# Altium project 九键触摸面板-控制板-V2.PrjPCB
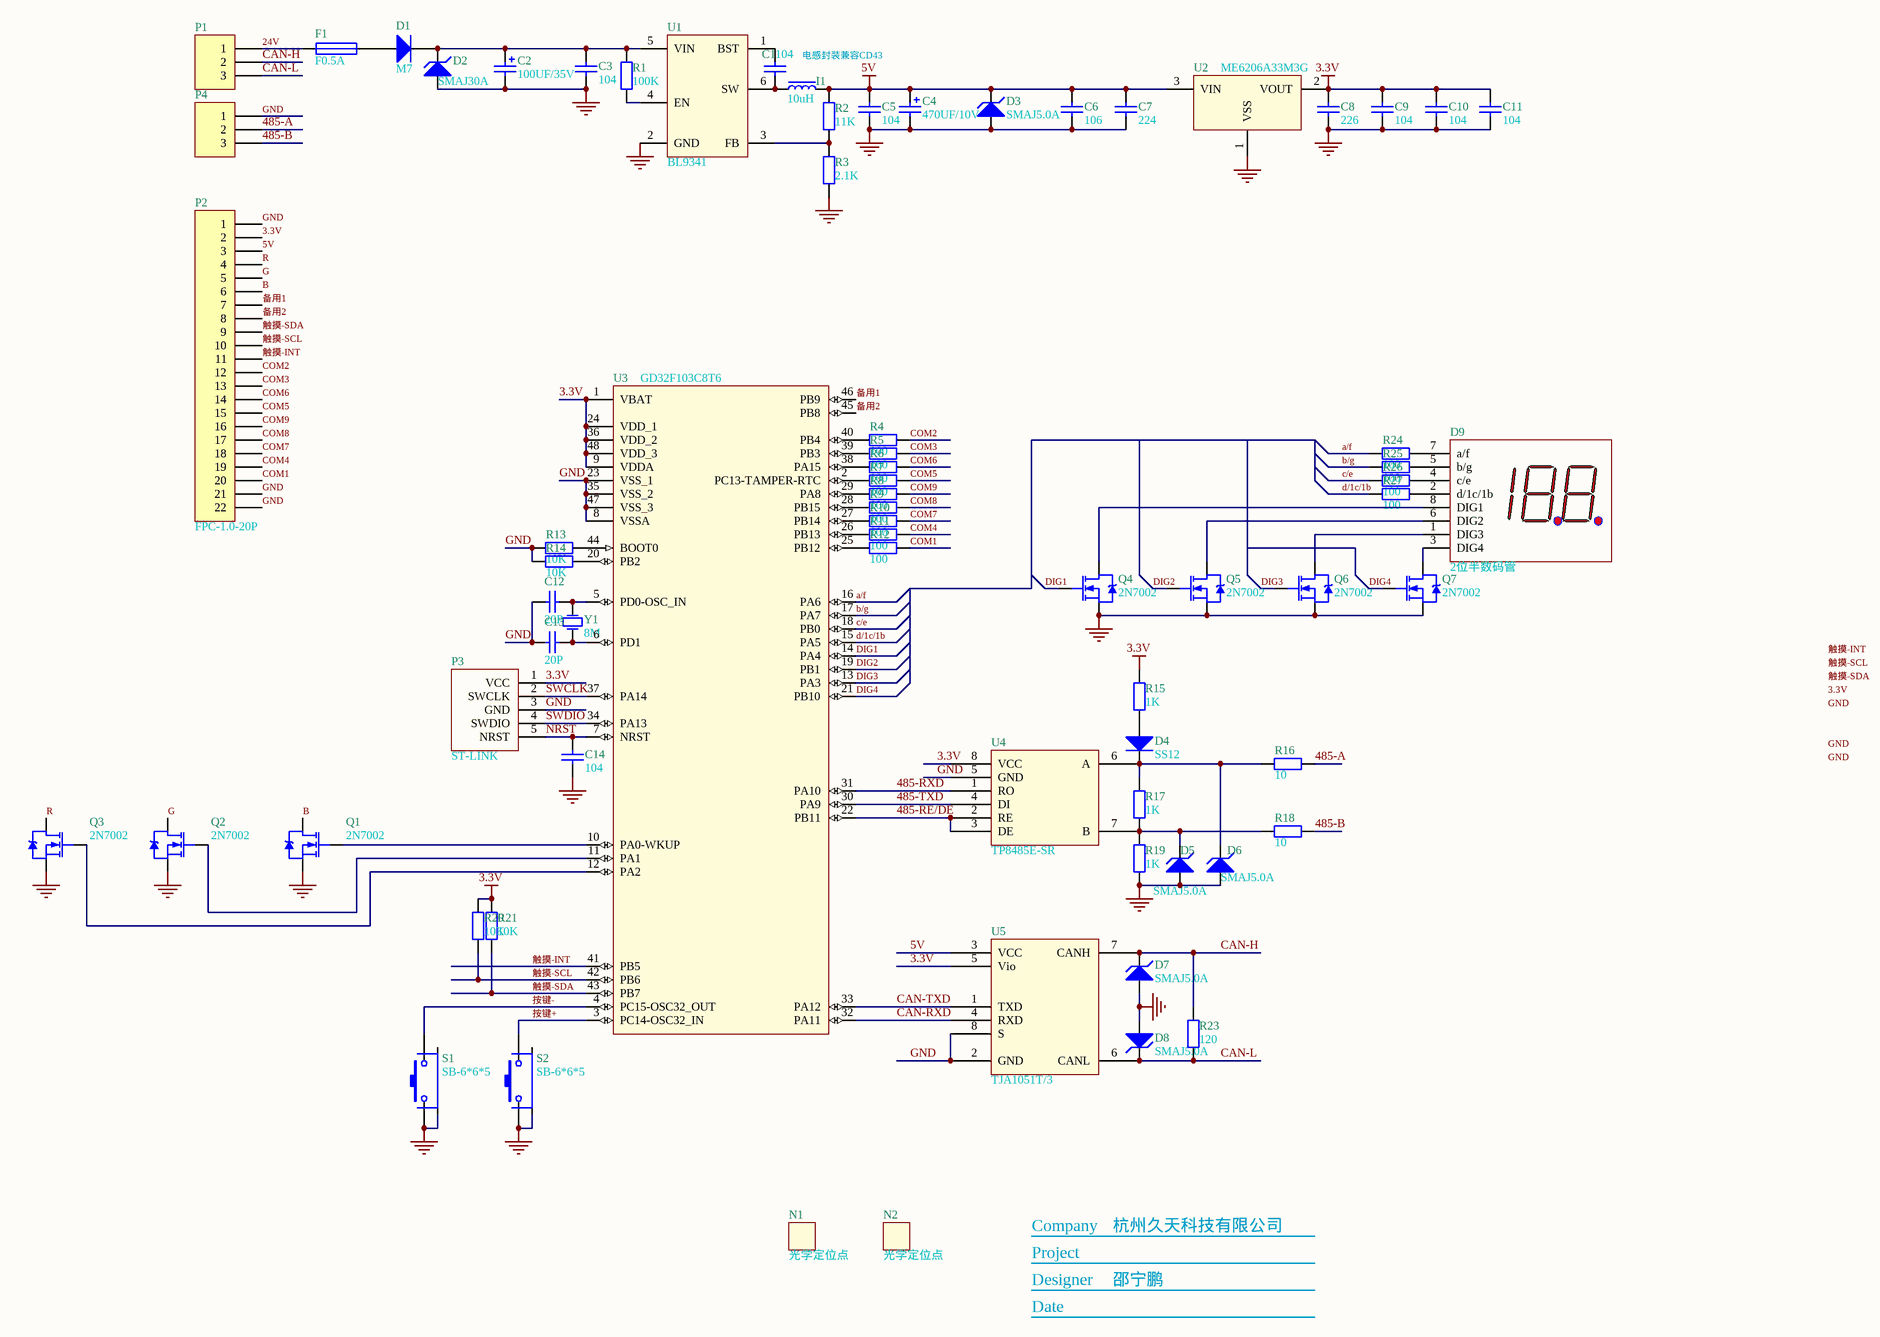
[diagram p0: 九键触摸面板-控制板-V2.SchDoc]
1 sheet, 72 parts. Net scope: global (net labels, ports and power ports of the same name join across sheets).
Board file: 九键触摸面板-控制板-V2.PcbDoc

## Sheet 九键触摸面板-控制板-V2.SchDoc
size A1

### Parts
C1  104  [C-0603]
C2  100UF/35V  [贴片固态电容6.3*7.7]
C3  104  [C-0603]
C4  470UF/10V  [贴片固态电容6.3*7.7]
C5  104  [C-0603]
C6  106  [C-0603]
C7  224  [C-0603]
C8  226  [C-0603]
C9  104  [C-0603]
C10  104  [C-0603]
C11  104  [C-0603]
C12  20P  [C-0603]
C13  20P  [C-0603]
C14  104  [C-0603]
D1  M7  [SMA]
D2  SMAJ30A  [SMA]
D3  SMAJ5.0A  [SMA]
D4  SS12  [SOD-323/0805]
D5  SMAJ5.0A  [SMA]
D6  SMAJ5.0A  [SMA]
D7  SMAJ5.0A  [SMA]
D8  SMAJ5.0A  [SMA]
D9  2位半数码管  [2位半0.25英寸]
F1  F0.5A  [FUSE-3*10带引线]
I1  10uH  [4030]
N1  光学定位点  [MARK-1mm-3mm]
N2  光学定位点  [MARK-1mm-3mm]
P1  (no value)  [KF128-3P]
P2  FPC-1.0-20P  [FPC-1.0mm_20P下接翻盖]
P3  ST-LINK  [5P下载口]
P4  (no value)  [KF128-3P]
Q1  2N7002  [SOT-23]
Q2  2N7002  [SOT-23]
Q3  2N7002  [SOT-23]
Q4  2N7002  [SOT-23]
Q5  2N7002  [SOT-23]
Q6  2N7002  [SOT-23]
Q7  2N7002  [SOT-23]
R1  100K  [R-0603]
R2  11K  [R-0603]
R3  2.1K  [R-0603]
R4  100  [R-0603]
R5  100  [R-0603]
R6  100  [R-0603]
R7  100  [R-0603]
R8  100  [R-0603]
R9  100  [R-0603]
R10  100  [R-0603]
R11  100  [R-0603]
R12  100  [R-0603]
R13  10K  [R-0603]
R14  10K  [R-0603]
R15  1K  [R-0603]
R16  10  [R-0603]
R17  1K  [R-1206]
R18  10  [R-0603]
R19  1K  [R-0603]
R20  10K  [R-0603]
R21  10K  [R-0603]
R23  120  [R-1206]
R24  100  [R-0603]
R25  100  [R-0603]
R26  100  [R-0603]
R27  100  [R-0603]
S1  SB-6*6*5  [SB-3*6*3.5]
S2  SB-6*6*5  [SB-3*6*3.5]
U1  BL9341  [SOT-23-6-m]
U2  ME6206A33M3G  [SOT-23]
U3  GD32F103C8T6  [LQFP48-L]
U4  TP8485E-SR  [SOP-8-m]
U5  TJA1051T/3  [SOP-8-M]
Y1  8M  [HC-49SMD]

### Nets
3.3V: C8.2 C9.2 C10.2 C11.2 P2.2 P3.1(VCC) R15.1 R20.2 R21.2 U2.2(VOUT) U3.1(VBAT) U3.9(VDDA) U3.24(VDD_1) U3.36(VDD_2) U3.48(VDD_3) U4.8(VCC) U5.5(Vio)
5V: C4.1 C5.2 C6.2 C7.2 D3.2(K) I1.2 P2.3 R2.1 U2.3(VIN) U5.3(VCC)
GND: C2.2 C3.1 C4.2 C5.1 C6.1 C7.1 C8.1 C9.1 C10.1 C11.1 C12.1 C13.1 C14.1 D2.1(A) D3.1(A) D5.1(A) D6.1(A) D7.1(A) D8.1(A) P2.1 P2.21 P2.22 P3.3(GND) P4.1 Q1.2(S) Q2.2(S) Q3.2(S) Q4.2(S) Q5.2(S) Q6.2(S) Q7.2(S) R3.2 R13.2 R14.2 R19.1 S1.2 S1.3 S2.2 S2.3 U1.2(GND) U2.1(VSS) U3.8(VSSA) U3.23(VSS_1) U3.35(VSS_2) U3.47(VSS_3) U4.5(GND) U5.2(GND) U5.8(S)
24V: F1.1 P1.1
485-A: P4.2 R16.1
485-B: P4.3 R18.1
485-RE/DE: U3.22(PB11) U4.2(RE) U4.3(DE)
485-RXD: U3.31(PA10) U4.1(RO)
485-TXD: U3.30(PA9) U4.4(DI)
a/f: R24.1 U3.16(PA6)
B: P2.6 Q1.3(D)
b/g: R25.1 U3.17(PA7)
c/e: R26.1 U3.18(PB0)
CAN-H: D7.2(K) P1.2 R23.1 U5.7(CANH)
CAN-L: D8.2(K) P1.3 R23.2 U5.6(CANL)
CAN-RXD: U3.32(PA11) U5.4(RXD)
CAN-TXD: U3.33(PA12) U5.1(TXD)
COM1: P2.20 R12.2
COM2: P2.12 R4.2
COM3: P2.13 R5.2
COM4: P2.19 R11.2
COM5: P2.15 R7.2
COM6: P2.14 R6.2
COM7: P2.18 R10.2
COM8: P2.17 R9.2
COM9: P2.16 R8.2
d/1c/1b: R27.1 U3.15(PA5)
DIG1: Q4.1(G) U3.14(PA4)
DIG2: Q5.1(G) U3.19(PB1)
DIG3: Q6.1(G) U3.13(PA3)
DIG4: Q7.1(G) U3.21(PB10)
G: P2.5 Q2.3(D)
NRST: C14.2 P3.5(NRST) U3.7(NRST)
R: P2.4 Q3.3(D)
SWCLK: P3.2(SWCLK) U3.37(PA14)
SWDIO: P3.4(SWDIO) U3.34(PA13)
备用1: P2.7 U3.46(PB9)
备用2: P2.8 U3.45(PB8)
按键+: S2.1 U3.3(PC14-OSC32_IN)
按键-: S1.1 U3.4(PC15-OSC32_OUT)
触摸-INT: P2.11 U3.41(PB5)
触摸-SCL: P2.10 R20.1 U3.42(PB6)
触摸-SDA: P2.9 R21.1 U3.43(PB7)
NetC1_1: C1.1 I1.1 U1.6(SW)
NetC1_2: C1.2 U1.1(BST)
NetC2_1: C2.1 C3.2 D1.2(K) D2.2(K) R1.1 U1.5(VIN)
NetC12_2: C12.2 U3.5(PD0-OSC_IN) Y1.2(OSC2)
NetC13_2: C13.2 U3.6(PD1) Y1.1(OSC1)
NetD1_1: D1.1(A) F1.2
NetD4_1: D4.1(A) R15.2
NetD4_2: D4.2(K) D6.2(K) R16.2 R17.1 U4.6(A)
NetD5_2: D5.2(K) R17.2 R18.2 R19.2 U4.7(B)
NetD9_1: D9.1(DIG3) Q6.3(D)
NetD9_2: D9.2(d/1c/1b) R27.2
NetD9_3: D9.3(DIG4) Q7.3(D)
NetD9_4: D9.4(c/e) R26.2
NetD9_5: D9.5(b/g) R25.2
NetD9_6: D9.6(DIG2) Q5.3(D)
NetD9_7: D9.7(a/f) R24.2
NetD9_8: D9.8(DIG1) Q4.3(D)
NetQ1_1: Q1.1(G) U3.10(PA0-WKUP)
NetQ2_1: Q2.1(G) U3.11(PA1)
NetQ3_1: Q3.1(G) U3.12(PA2)
NetR1_2: R1.2 U1.4(EN)
NetR2_2: R2.2 R3.1 U1.3(FB)
NetR4_1: R4.1 U3.40(PB4)
NetR5_1: R5.1 U3.39(PB3)
NetR6_1: R6.1 U3.38(PA15)
NetR7_1: R7.1 U3.2(PC13-TAMPER-RTC)
NetR8_1: R8.1 U3.29(PA8)
NetR9_1: R9.1 U3.28(PB15)
NetR10_1: R10.1 U3.27(PB14)
NetR11_1: R11.1 U3.26(PB13)
NetR12_1: R12.1 U3.25(PB12)
NetR13_1: R13.1 U3.44(BOOT0)
NetR14_1: R14.1 U3.20(PB2)

### Notes on the sheet
- 电感封装兼容CD43
- Company
- 杭州久天科技有限公司
- Project
- Designer
- Date
- 邵宁鹏
- Labels drawn without touching a wire or pin: 3.3V, GND, 触摸-INT, 触摸-SCL, 触摸-SDA

### Library data of the parts
C1 C3 C5-C11 = Cap: Capacitor; Published: 8-Jun-2000; LatestRevisionDate: 17-Jul-2002; LatestRevisionNote: Re-released for DXP Platform.; PackageReference: RAD-0.3; Publisher: Altium Limited
C2 C4 = Cap Pol1: Polarized Capacitor (Radial); Published: 8-Jun-2000; LatestRevisionDate: 17-Jul-2002; LatestRevisionNote: Re-released for DXP Platform.; PackageReference: RB7.6-15; Publisher: Altium Limited
C12-C14 = Cap-0603: 0805; Published: 8-Jun-2000; LatestRevisionDate: 17-Jul-2002; LatestRevisionNote: Re-released for DXP Platform.; PackageReference: RAD-0.3; Publisher: Altium Limited
D1 = M7: SMA; Published: 8-Jun-2000; LatestRevisionDate: 17-Jul-2002; LatestRevisionNote: Re-released for DXP Platform.; DatasheetVersion: 1989; PackageVersion: 1989; PackageReference: DO-35A; Publisher: Altium Limited; Code_JEDEC: DO-204-AH; ComponentLink1Description: Manufacturer Link; ComponentLink1URL: http://www.national.com/
D2 D3 D5-D8 = TVS-1: SMB
D4 = SS14: SMA
F1 = Fuse 1: Fuse; Published: 8-Jun-2000; LatestRevisionDate: 17-Jul-2002; LatestRevisionNote: Re-released for DXP Platform.; PackageReference: PIN-W2/E2.8; Publisher: Altium Limited
I1 = Inductance3
N1 N2 = 无引脚
P1 P4 = Header 3: Header, 3-Pin; LatestRevisionDate: 17-Jul-2002; LatestRevisionNote: Re-released for DXP Platform.; Publisher: Altium Limited
P2 = Header 22: Header, 22-Pin; LatestRevisionDate: 17-Jul-2002; LatestRevisionNote: Re-released for DXP Platform.; Publisher: Altium Limited
P3 = ST-LINK-STM32
R1-R14 R20 R21 R24-R27 = Res2-0603: 0603; Published: 8-Jun-2000; LatestRevisionDate: 17-Jul-2002; LatestRevisionNote: Re-released for DXP Platform.; PackageReference: AXIAL-0.4; Publisher: Altium Limited
R15 R17 R19 = Res2: Resistor; Published: 8-Jun-2000; LatestRevisionDate: 17-Jul-2002; LatestRevisionNote: Re-released for DXP Platform.; PackageReference: AXIAL-0.4; Publisher: Altium Limited
  R17: Value: 1K
R16 R18 R23 = Res2: Resistor; Value: 1K; Published: 8-Jun-2000; LatestRevisionDate: 17-Jul-2002; LatestRevisionNote: Re-released for DXP Platform.; PackageReference: AXIAL-0.4; Publisher: Altium Limited
U2 = ME6206A33M3G: LDO稳压 SOT-23
U4 = MAX3082: RS485总线转串口
Y1 = 晶振
S1 S2 = SB-6*6*5: Published: 24-Mar-1999; LatestRevisionDate: 17-Jul-2002; LatestRevisionNote: Re-released for DXP Platform.; PackageReference: SPST-2; Publisher: Altium Limited